# EAGLE schematic tin_of_fets (EAGLE 7.7.0)
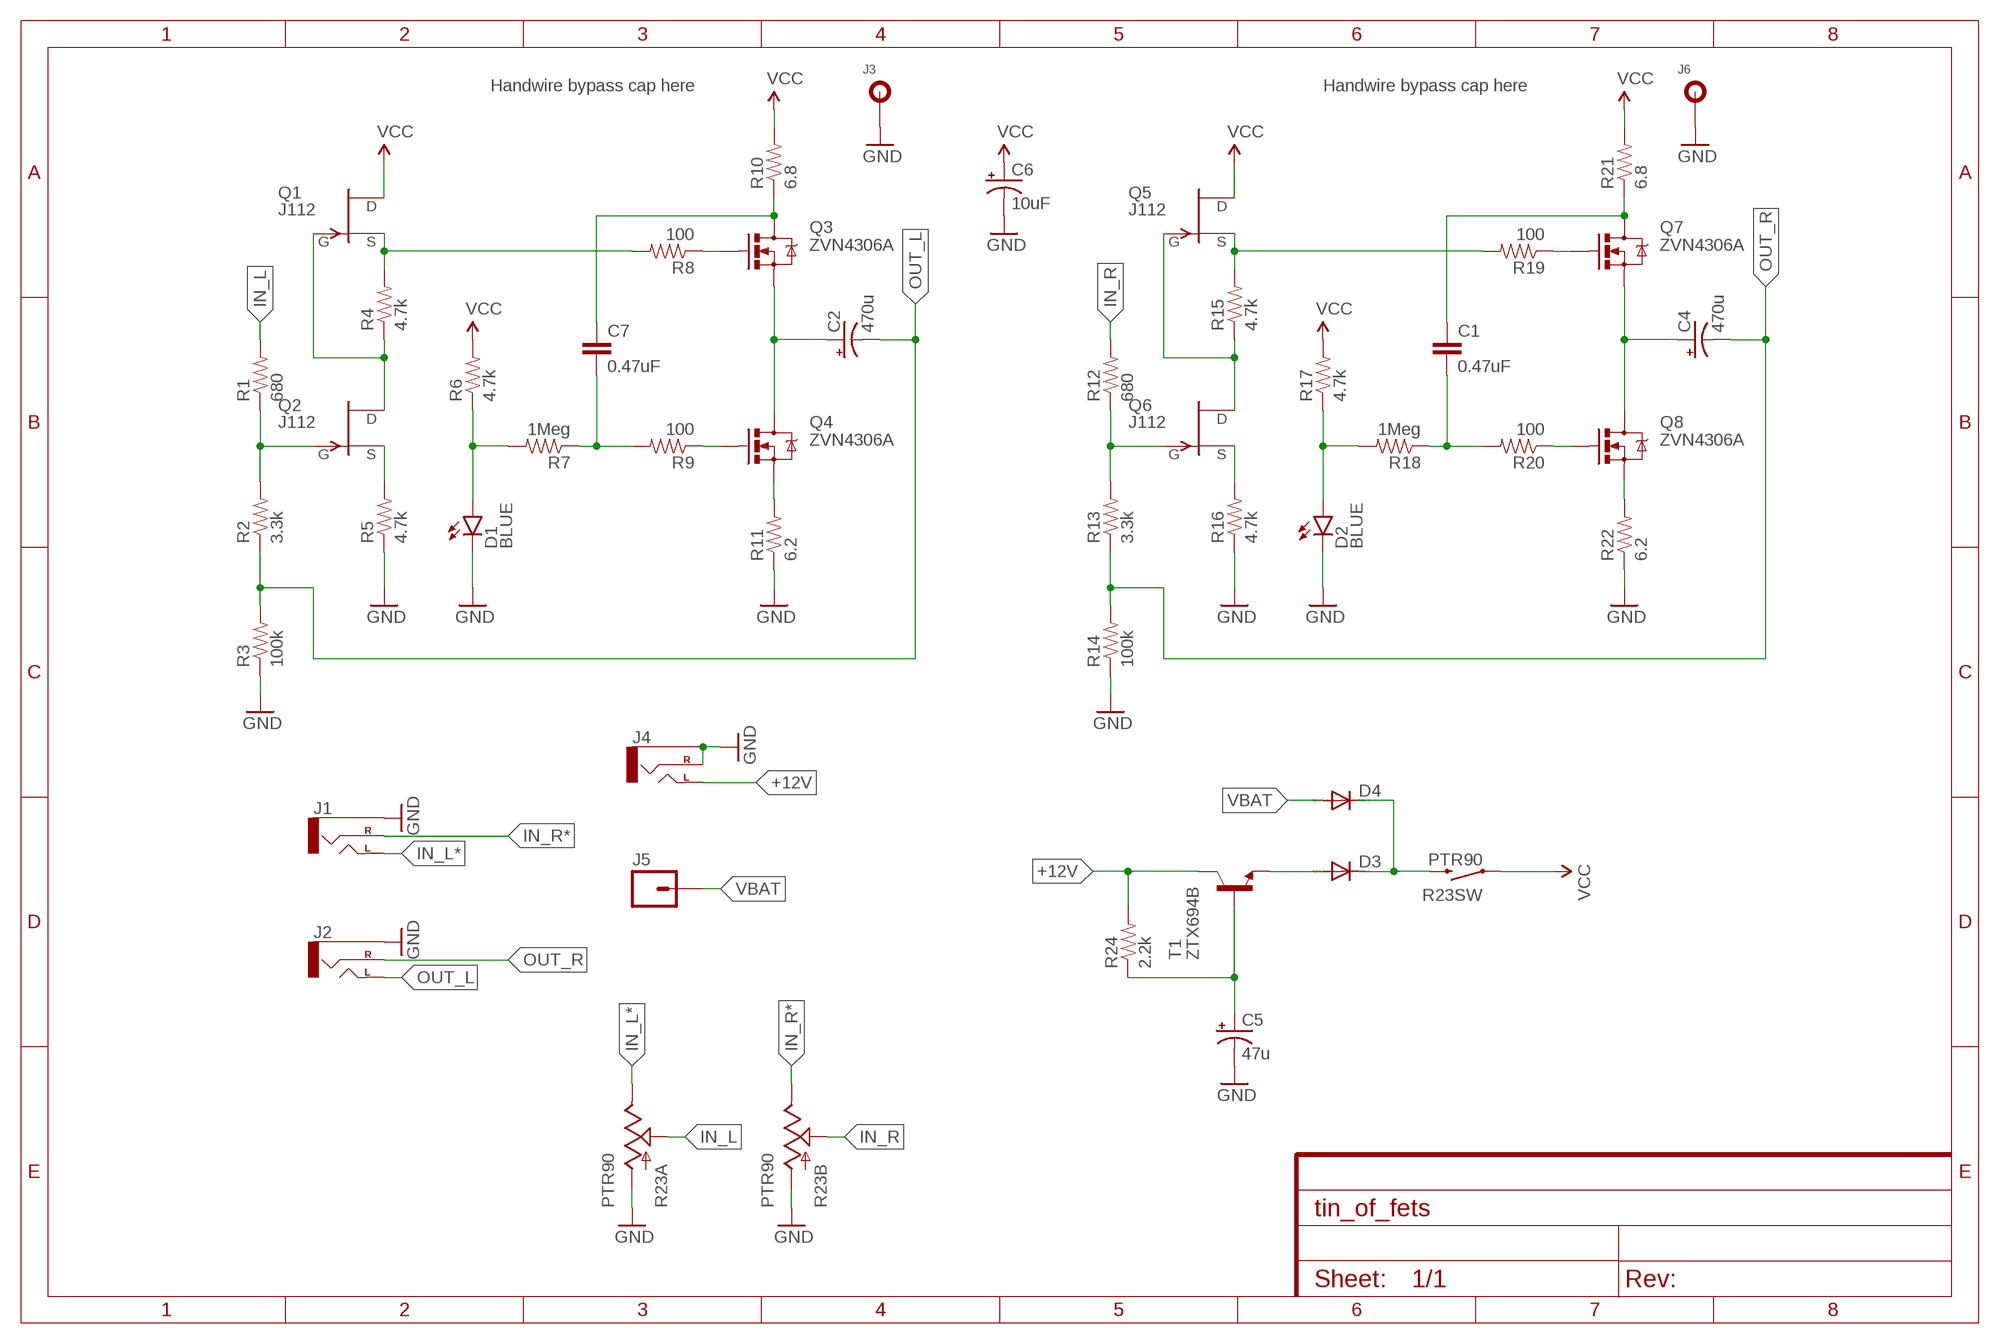
[diagram p0: schematic, sheet 1]

## Parts
A1  9V-BATTERY-DOCU  [9V-BATTERY-DIM]
A2  9V-BATTERY-DOCU  [9V-BATTERY-DIM]
A3  ALTOIDS-DOCU  [ALTOIDS-INNER-DIM]
C1  0.47uF  C5/3.5  [C5B3.5]
C2  470u  CAP_POLPTH4  [CPOL-RADIAL-1000UF-25V]
C4  470u  CAP_POLPTH4  [CPOL-RADIAL-1000UF-25V]
C5  47u  CAP_POLPTH2  [CPOL-RADIAL-10UF-25V]
C6  10uF  CAP_POLPTH2  [CPOL-RADIAL-10UF-25V]
C7  0.47uF  C5/3.5  [C5B3.5]
D1  BLUE  LED3MM  [LED3MM]
D2  BLUE  LED3MM  [LED3MM]
D3  DIODE-C1702-05  [C1702-05]
D4  DIODE-C1702-05  [C1702-05]
J1  AUDIO-JACK2.5MM  [STEREOJACK2.5MM_STEREOJACK2.5MM]
J2  AUDIO-JACK2.5MM  [STEREOJACK2.5MM_STEREOJACK2.5MM]
J3  PAD-NO-THERMAL  [PAD-NO-THERMAL]
J4  AUDIO-JACK2.5MM  [STEREOJACK2.5MM_STEREOJACK2.5MM]
J5  M01PTH  [1X01]
J6  PAD-NO-THERMAL  [PAD-NO-THERMAL]
Q1  J112  J201  [TO92]
Q2  J112  J201  [TO92]
Q3  ZVN4306A  MOSFET-NCHANNEL2N7000  [TO-92]
Q4  ZVN4306A  MOSFET-NCHANNEL2N7000  [TO-92]
Q5  J112  J201  [TO92]
Q6  J112  J201  [TO92]
Q7  ZVN4306A  MOSFET-NCHANNEL2N7000  [TO-92]
Q8  ZVN4306A  MOSFET-NCHANNEL2N7000  [TO-92]
R1  680  RESISTORPTH-1/4W-VERT-SM  [AXIAL-0.1-SM]
R2  3.3k  RESISTORPTH-1/4W-VERT-SM  [AXIAL-0.1-SM]
R3  100k  RESISTORPTH-1/4W-VERT-SM  [AXIAL-0.1-SM]
R4  4.7k  RESISTORPTH-1/4W-VERT-SM  [AXIAL-0.1-SM]
R5  4.7k  RESISTORPTH-1/4W-VERT-SM  [AXIAL-0.1-SM]
R6  4.7k  RESISTORPTH-1/4W-VERT-SM  [AXIAL-0.1-SM]
R7  1Meg  RESISTORPTH-1/4W-VERT-SM  [AXIAL-0.1-SM]
R8  100  RESISTORPTH-1/4W-VERT-SM  [AXIAL-0.1-SM]
R9  100  RESISTORPTH-1/4W-VERT-SM  [AXIAL-0.1-SM]
R10  6.8  RESISTORPTH-1/4W-VERT-SM  [AXIAL-0.1-SM]
R11  6.2  RESISTORPTH-1/4W-VERT-SM  [AXIAL-0.1-SM]
R12  680  RESISTORPTH-1/4W-VERT-SM  [AXIAL-0.1-SM]
R13  3.3k  RESISTORPTH-1/4W-VERT-SM  [AXIAL-0.1-SM]
R14  100k  RESISTORPTH-1/4W-VERT-SM  [AXIAL-0.1-SM]
R15  4.7k  RESISTORPTH-1/4W-VERT-SM  [AXIAL-0.1-SM]
R16  4.7k  RESISTORPTH-1/4W-VERT-SM  [AXIAL-0.1-SM]
R17  4.7k  RESISTORPTH-1/4W-VERT-SM  [AXIAL-0.1-SM]
R18  1Meg  RESISTORPTH-1/4W-VERT-SM  [AXIAL-0.1-SM]
R19  100  RESISTORPTH-1/4W-VERT-SM  [AXIAL-0.1-SM]
R20  100  RESISTORPTH-1/4W-VERT-SM  [AXIAL-0.1-SM]
R21  6.8  RESISTORPTH-1/4W-VERT-SM  [AXIAL-0.1-SM]
R22  6.2  RESISTORPTH-1/4W-VERT-SM  [AXIAL-0.1-SM]
R23  PTR90  [PTR902]
R24  2.2k  RESISTORPTH-1/4W-VERT-SM  [AXIAL-0.1-SM]
T1  ZTX694B  2N3565  [TO92]

## Nets
+12V: J4.TIP1(LEFT) J4.TIP2(LEFT) R24.P$2 T1.1(C)
GND: C5.2(-) C6.2(-) D1.K(C) D2.K(C) J1.SHIELD(SLEEVE) J2.SHIELD(SLEEVE) J3.P$1 J4.RING(RIGHT) J4.SHIELD(SLEEVE) J6.P$1 R3.P$1 R5.P$1 R11.P$1 R14.P$1 R16.P$1 R22.P$1 R23.R1.1(A:A) R23.R2.1(B:A)
IN_L: R1.P$2 R23.R1.2(A:S)
IN_L*: J1.TIP1(LEFT) J1.TIP2(LEFT) R23.R1.3(A:E)
IN_R: R12.P$2 R23.R2.2(B:S)
IN_R*: J1.RING(RIGHT) R23.R2.3(B:E)
N$1: Q1.2(S) R4.P$2 R8.P$2
N$2: Q1.1(G) Q2.3(D) R4.P$1
N$3: Q2.2(S) R5.P$2
N$4: Q5.2(S) R15.P$2 R19.P$2
N$5: Q3.2(G) R8.P$1
N$6: Q2.1(G) R1.P$1 R2.P$2
N$7: Q5.1(G) Q6.3(D) R15.P$1
N$8: Q4.2(G) R9.P$1
N$10: Q4.1(S) R11.P$2
N$11: C7.1 Q3.3(D) R10.P$1
N$12: Q6.2(S) R16.P$2
N$13: C7.2 R7.P$1 R9.P$2
N$14: D1.A R6.P$1 R7.P$2
N$15: Q6.1(G) R12.P$1 R13.P$2
N$16: Q7.2(G) R19.P$1
N$17: Q8.2(G) R20.P$1
N$19: Q8.1(S) R22.P$2
N$20: C1.1 Q7.3(D) R21.P$1
N$21: C1.2 R18.P$1 R20.P$2
N$22: D2.A R17.P$1 R18.P$2
N$23: D3.A T1.3(E)
N$24: C5.1(+) R24.P$1 T1.2(B)
OUT_L: C2.- J2.TIP1(LEFT) J2.TIP2(LEFT) R2.P$1 R3.P$2
OUT_L*: C2.+ Q3.1(S) Q4.3(D)
OUT_R: C4.- J2.RING(RIGHT) R13.P$1 R14.P$2
OUT_R*: C4.+ Q7.1(S) Q8.3(D)
VBAT: D4.A J5.1
VCC: C6.1(+) Q1.3(D) Q5.3(D) R6.P$2 R10.P$2 R17.P$2 R21.P$2 R23.SW1
VCC*: D3.C D4.C R23.SW2

## Notes on the sheet
- Handwire bypass cap here | Handwire bypass cap here

## Library data of the parts
A1 A2 = my:9V-BATTERY-DOCU
A3 = my:ALTOIDS-DOCU
C1 C7 = capacitor-wima:C: CAPACITOR naming: grid - package width
C2 C4-C6 = SparkFun-Capacitors:CAP_POL: Capacitor Polarized These are standard SMD and PTH capacitors. Normally 10uF, 47uF, and 100uF in electrolytic and tantalum varieties. Always verify the external diameter of the through hole cap, it varies with capacity, voltage, and manufacturer. The EIA devices should be standard.
D1 D2 = SparkFun-LED:LED: LEDs Standard schematic elements and footprints for 5mm, 3mm, 1206, and 0603 sized LEDs. 5mm - Spark Fun Electronics SKU : COM-00529 (and others); PROD_ID: DIO-08794
D3 D4 = diode:DIODE-: DIODE
J1 J2 J4 = my-conn:AUDIO-JACK: 3.5mm Audio Jack Simple 3.5mm common PCB mount audio jack. Variant PTH is our storefront SKU PRT-08032
J3 J6 = my:PAD-NO-THERMAL
J5 = SparkFun-Connectors:M01: Header 1 Standard 1-pin 0.1" header. Use with straight break away headers (SKU : PRT-00116), right angle break away headers (PRT-00553), swiss pins (PRT-00743), machine pins (PRT-00117), and female headers (PRT-00115). SMTSO-256-ET is a "flush mount" nut for a 4-40 screw. The older package used to be too tight, and did not allow it to sit properly thru the drill hit. The latest (0.165DIA) fits nice and snug.
Q1 Q2 Q5 Q6 = transistor-fet:?20*: TEMIC / Siliconix N-Channel JFET Source: JFET-J201_Siliconix_data.pdf
Q3 Q4 Q7 Q8 = SparkFun-DiscreteSemi:MOSFET-NCHANNEL: Common NMOSFET Parts MFG P/N Store ID Prod ID FDD8780 TRANS-09984 SI7820DN TRANS-11055 FDS6630A IC-08089 2N7002PW TRANS-11151 FQP30N06L COM-10213 TRANS-10060 BSS123LT1G TRANS-08345 BSS138 TRANS-00830 BS170 2N7000
R1-R22 R24 = my-res:RESISTOR: Resistor Basic schematic elements and footprints for 0603, 1206, and PTH resistors.
R23 = my:PTR90: PTD90 Series - 9 mm Multi-Ganged Potentiometer
T1 = transistor-neu-to92:2N3565: NPN TRANSISTOR